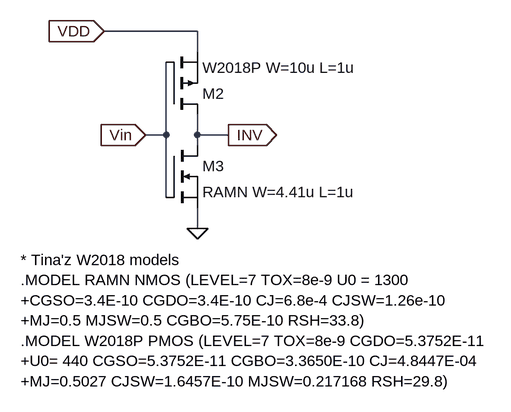
[diagram p0: schematic INV_SRAM3sramtz.asc]
INV_SRAM3sramtz.asc, the LTspice schematic file:
Version 4
SHEET 1 1248 680
WIRE 256 16 112 16
WIRE 256 48 256 16
WIRE 208 176 208 64
WIRE 208 176 176 176
WIRE 256 176 256 144
WIRE 304 176 256 176
WIRE 256 192 256 176
WIRE 208 272 208 176
WIRE 256 320 256 288
FLAG 256 320 0
FLAG 112 16 VDD
IOPIN 112 16 In
FLAG 176 176 Vin
IOPIN 176 176 In
FLAG 304 176 INV
IOPIN 304 176 Out
SYMBOL nmos 208 192 R0
SYMATTR InstName M3
SYMATTR Value RAMN W=4.41u L=1u
SYMBOL pmos 208 144 M180
SYMATTR InstName M2
SYMATTR Value W2018P W=10u L=1u
TEXT -16 368 Left 2 !* Tina'z W2018 models\n.MODEL RAMN NMOS (LEVEL=7 TOX=8e-9 U0 = 1300\n+CGSO=3.4E-10 CGDO=3.4E-10 CJ=6.8e-4 CJSW=1.26e-10\n+MJ=0.5 MJSW=0.5 CGBO=5.75E-10 RSH=33.8)\n.MODEL W2018P PMOS (LEVEL=7 TOX=8e-9 CGDO=5.3752E-11\n+U0= 440 CGSO=5.3752E-11 CGBO=3.3650E-10 CJ=4.8447E-04\n+MJ=0.5027 CJSW=1.6457E-10 MJSW=0.217168 RSH=29.8)

The netlist it stands for:
* INV_SRAM3sramtz.asc
M3 INV Vin 0 0 RAMN W=4.41u L=1u
M2 INV Vin VDD VDD W2018P W=10u L=1u
.model NMOS NMOS
.model PMOS PMOS
.lib standard.mos
* Tina'z W2018 models
.MODEL RAMN NMOS (LEVEL=7 TOX=8e-9 U0 = 1300
+CGSO=3.4E-10 CGDO=3.4E-10 CJ=6.8e-4 CJSW=1.26e-10
+MJ=0.5 MJSW=0.5 CGBO=5.75E-10 RSH=33.8)
.MODEL W2018P PMOS (LEVEL=7 TOX=8e-9 CGDO=5.3752E-11
+U0= 440 CGSO=5.3752E-11 CGBO=3.3650E-10 CJ=4.8447E-04
+MJ=0.5027 CJSW=1.6457E-10 MJSW=0.217168 RSH=29.8)
.backanno
.end